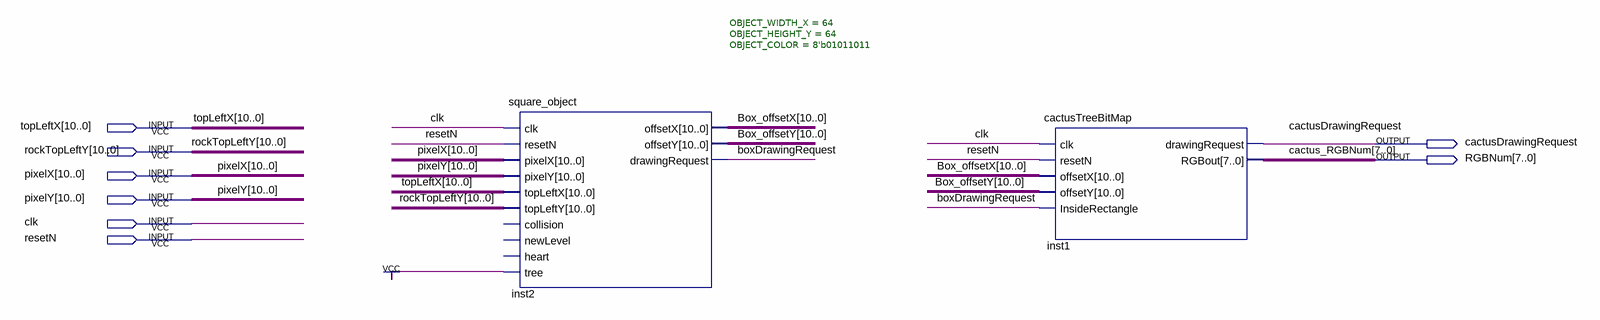
[diagram p0: schematic sheet]
// Quartus schematic Cactus_Block.bdf as structural Verilog: 2 symbols, 8 pins
module Cactus_Block (
  input  [10:0] topLeftX,
  input  [10:0] rockTopLeftY,
  input  [10:0] pixelX,
  input  [10:0] pixelY,
  input  clk,
  input  resetN,
  output cactusDrawingRequest,
  output [7:0] RGBNum
);

  wire boxDrawingRequest;
  wire [10:0] Box_offsetX, Box_offsetY;

  square_object #(.OBJECT_WIDTH_X(64), .OBJECT_HEIGHT_Y(64), .OBJECT_COLOR(8'b01011011)) inst2 (
    .clk(clk), .resetN(resetN), .pixelX(pixelX), .pixelY(pixelY), .topLeftX(topLeftX),
    .topLeftY(rockTopLeftY), .tree(1'b1), .offsetX(Box_offsetX), .offsetY(Box_offsetY),
    .drawingRequest(boxDrawingRequest));  // open: collision, newLevel, heart
  cactusTreeBitMap inst1 (
    .clk(clk), .resetN(resetN), .offsetX(Box_offsetX), .offsetY(Box_offsetY),
    .InsideRectangle(boxDrawingRequest), .drawingRequest(cactusDrawingRequest), .RGBout(RGBNum));

  // Other names for the same wires on the sheet: cactus_RGBNum[7:0] = RGBNum
endmodule
